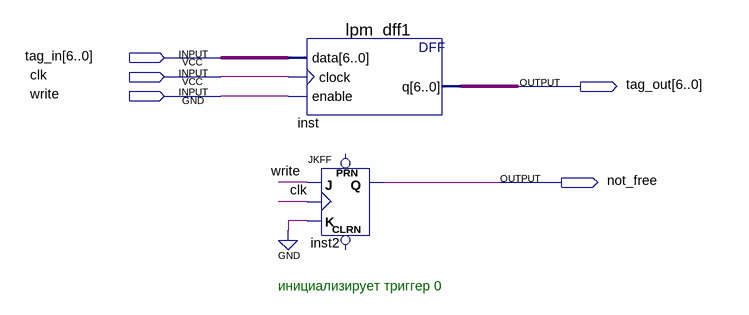
[diagram p0: schematic sheet]
// Quartus schematic tag.bdf as structural Verilog: 2 symbols, 5 pins
module tag (
  input  [6:0] tag_in,
  input  clk,
  input  write,
  output [6:0] tag_out,
  output not_free
);

  lpm_dff1 inst (.data(tag_in), .clock(clk), .enable(write), .q(tag_out));
  JKFF inst2 (.K(1'b0), .J(write), .CLK(clk), .Q(not_free));  // open: PRN, CLRN

  // Notes on the sheet:
  //   инициализирует триггер 0
endmodule
